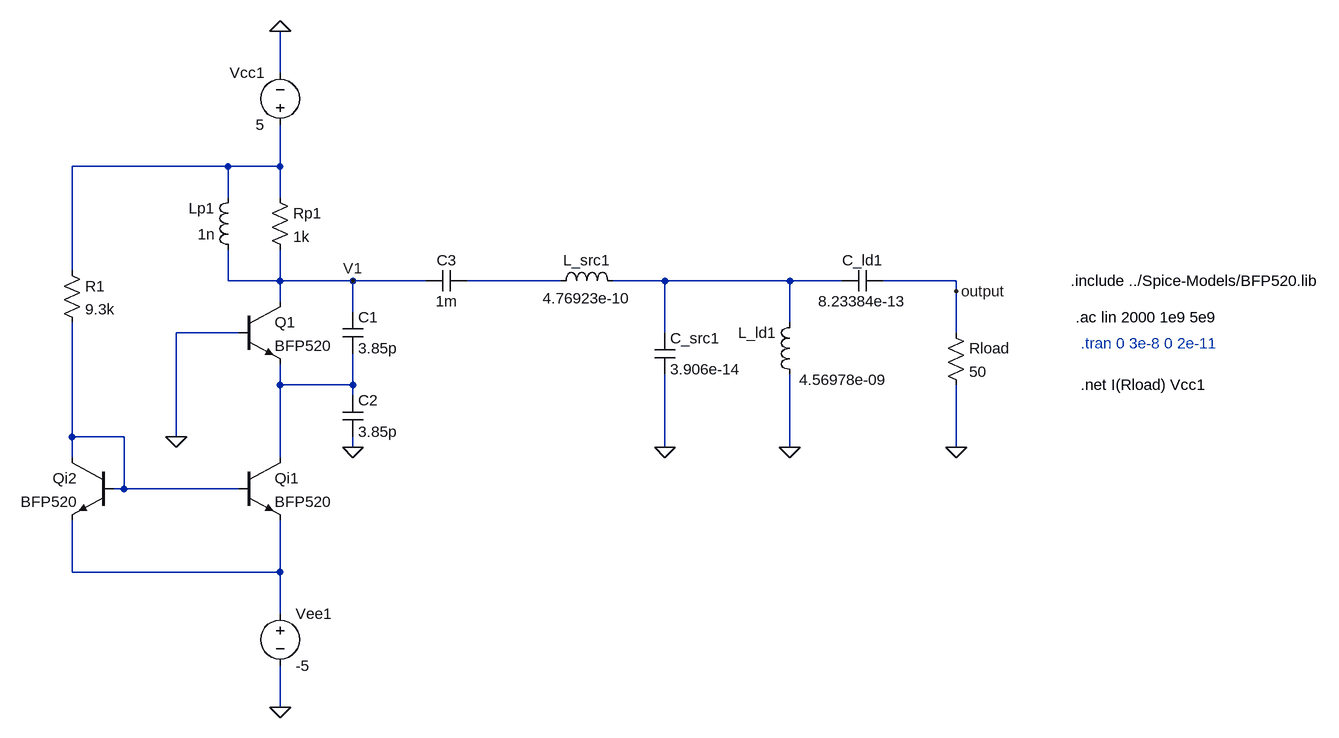
[diagram p0: schematic Osc-with-Matching.asc]
Osc-with-Matching.asc, the LTspice schematic file:
Version 4
SHEET 1 1996 896
WIRE 400 -96 400 -160
WIRE 320 48 80 48
WIRE 400 48 400 -16
WIRE 400 48 320 48
WIRE 320 96 320 48
WIRE 400 96 400 48
WIRE 80 208 80 48
WIRE 320 224 320 176
WIRE 400 224 400 176
WIRE 400 224 320 224
WIRE 512 224 400 224
WIRE 624 224 512 224
WIRE 832 224 688 224
WIRE 992 224 912 224
WIRE 1184 224 992 224
WIRE 1264 224 1184 224
WIRE 1440 224 1328 224
WIRE 1440 240 1440 224
WIRE 400 256 400 224
WIRE 512 272 512 224
WIRE 1184 288 1184 224
WIRE 336 304 240 304
WIRE 992 304 992 224
WIRE 1440 304 1440 240
WIRE 400 384 400 352
WIRE 512 384 512 336
WIRE 512 384 400 384
WIRE 512 400 512 384
WIRE 80 464 80 288
WIRE 160 464 80 464
WIRE 240 464 240 304
WIRE 512 480 512 464
WIRE 992 480 992 368
WIRE 1184 480 1184 368
WIRE 1440 480 1440 384
WIRE 80 496 80 464
WIRE 400 496 400 384
WIRE 160 544 160 464
WIRE 160 544 144 544
WIRE 336 544 160 544
WIRE 80 672 80 592
WIRE 400 672 400 592
WIRE 400 672 80 672
WIRE 400 736 400 672
WIRE 400 880 400 816
FLAG 400 -160 0
FLAG 400 880 0
FLAG 240 464 0
FLAG 512 480 0
FLAG 512 224 V1
FLAG 992 480 0
FLAG 1184 480 0
FLAG 1440 480 0
FLAG 1440 240 output
SYMBOL npn 336 256 R0
SYMATTR InstName Q1
SYMATTR Value BFP520
SYMBOL ind 336 192 R180
WINDOW 0 36 80 Left 2
WINDOW 3 36 40 Left 2
SYMATTR InstName Lp1
SYMATTR Value 1n
SYMBOL Res 384 80 R0
SYMATTR InstName Rp1
SYMATTR Value 1k
SYMBOL Voltage 400 0 R180
WINDOW 0 24 96 Left 2
WINDOW 3 24 16 Left 2
SYMATTR InstName Vcc1
SYMATTR Value 5
SYMBOL npn 336 496 R0
SYMATTR InstName Qi1
SYMATTR Value BFP520
SYMBOL npn 144 496 M0
SYMATTR InstName Qi2
SYMATTR Value BFP520
SYMBOL Res 64 192 R0
SYMATTR InstName R1
SYMATTR Value 9.3k
SYMBOL Voltage 400 720 R0
SYMATTR InstName Vee1
SYMATTR Value -5
SYMBOL cap 496 272 R0
SYMATTR InstName C1
SYMATTR Value 3.85p
SYMBOL cap 496 400 R0
SYMATTR InstName C2
SYMATTR Value 3.85p
SYMBOL cap 688 208 R90
WINDOW 0 0 32 VBottom 2
WINDOW 3 32 32 VTop 2
SYMATTR InstName C3
SYMATTR Value 1m
SYMBOL ind 816 240 R270
WINDOW 0 32 56 VTop 2
WINDOW 3 5 56 VBottom 2
SYMATTR InstName L_src1
SYMATTR Value 4.76923e-10
SYMBOL ind 1200 384 R180
WINDOW 0 36 80 Left 2
WINDOW 3 -135 8 Left 2
SYMATTR InstName L_ld1
SYMATTR Value 4.56978e-09
SYMBOL cap 976 304 R0
SYMATTR InstName C_src1
SYMATTR Value 3.906e-14
SYMBOL cap 1328 208 R90
WINDOW 0 0 32 VBottom 2
WINDOW 3 32 32 VTop 2
SYMATTR InstName C_ld1
SYMATTR Value 8.23384e-13
SYMBOL Res 1424 288 R0
SYMATTR InstName Rload
SYMATTR Value 50
TEXT 1616 224 Left 2 !.include ../Spice-Models/BFP520.lib
TEXT 1624 280 Left 2 !.ac lin 2000 1e9 5e9
TEXT 1632 320 Left 2 ;.tran 0 3e-8 0 2e-11
TEXT 1632 384 Left 2 !.net I(Rload) Vcc1

The netlist it stands for:
* Osc-with-Matching.asc
Q1 V1 0 N004 0 BFP520
Lp1 V1 N001 1n
Rp1 N001 V1 1k
Vcc1 N001 0 5
Qi1 N004 N005 N006 0 BFP520
Qi2 N005 N005 N006 0 BFP520
R1 N001 N005 9.3k
Vee1 N006 0 -5
C1 V1 N004 3.85p
C2 N004 0 3.85p
C3 N002 V1 1m
L_src1 N002 N003 4.76923e-10
L_ld1 0 N003 4.56978e-09
C_src1 N003 0 3.906e-14
C_ld1 output N003 8.23384e-13
Rload output 0 50
.model NPN NPN
.model PNP PNP
.lib standard.bjt
.include ../Spice-Models/BFP520.lib
.ac lin 2000 1e9 5e9
* .tran 0 3e-8 0 2e-11
.net I(Rload) Vcc1
.backanno
.end